# Altium schematic sheet CUVET_DECTECT.SchDoc
size A; SheetNumber: 6; SheetTotal: 10
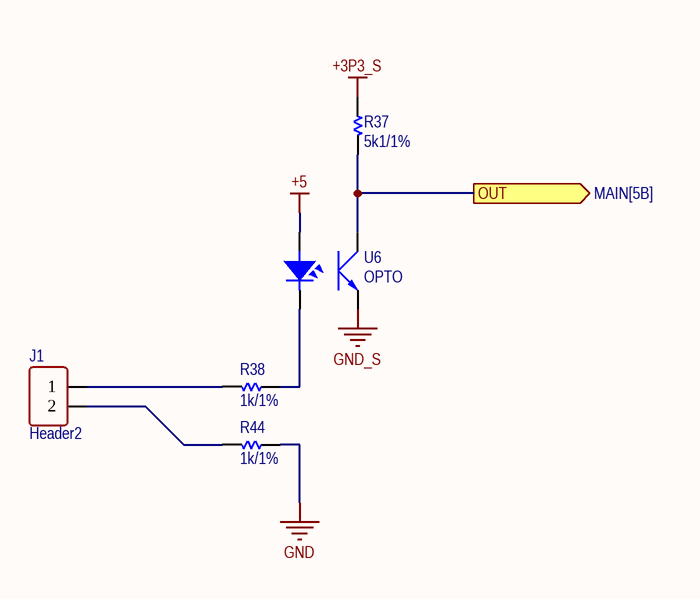
[diagram p0: CUVET_DECTECT.SchDoc]

## Parts
J1  Header2  [XH2.54-2-DIP]
R37  5k1/1%  [RES-SMD-0603]
R38  1k/1%  [RES-SMD-0603]
R44  1k/1%  [RES-SMD-0603]
U6  OPTO  [EL3H7]

## Ports
OUT (out, see MAIN[5B])

## Nets
+3P3_S: R37.1
+5: U6.A
GND: R44.2
GND_S: U6.E
OUT: R37.2 U6.C ; port OUT
NetJ1_1: J1.1 R38.1
NetJ1_2: J1.2 R44.1
NetR38_2: R38.2 U6.K

## Library data of the parts
J1 = Header2: Connector 2; Manufacturer: W¨¹rth Elektronik eiSos GmbH; partNo: 613002143121; ComponentLink1 Description: Manufacturer; ComponentLink2 Description: Datasheet; NoPins: 02; Created Date: 29 March 2013; ComponentLink1URL: http://www.we-online.com; ComponentLink2URL: http://katalog.we-online.de/em/datasheet/6130xx143121.pdf; Created by: Karrer Zheng
R37 = Res-SMD: ERJ-3EKF5101V; Manufacturer: Generic Components; Class: Passive; PN: ERJ-3EKF5101V; Publisher: Altium Hobart Technology Centre
R38 R44 = Res-SMD: ERJ-3EKF1001V; Manufacturer: Generic Components; Class: Passive; PN: ERJ-3EKF1001V; Publisher: Altium Hobart Technology Centre
U6 = OPTO: EL3H7(B)(TA)-VG; PN: EL3H7(B)(TA)-VG